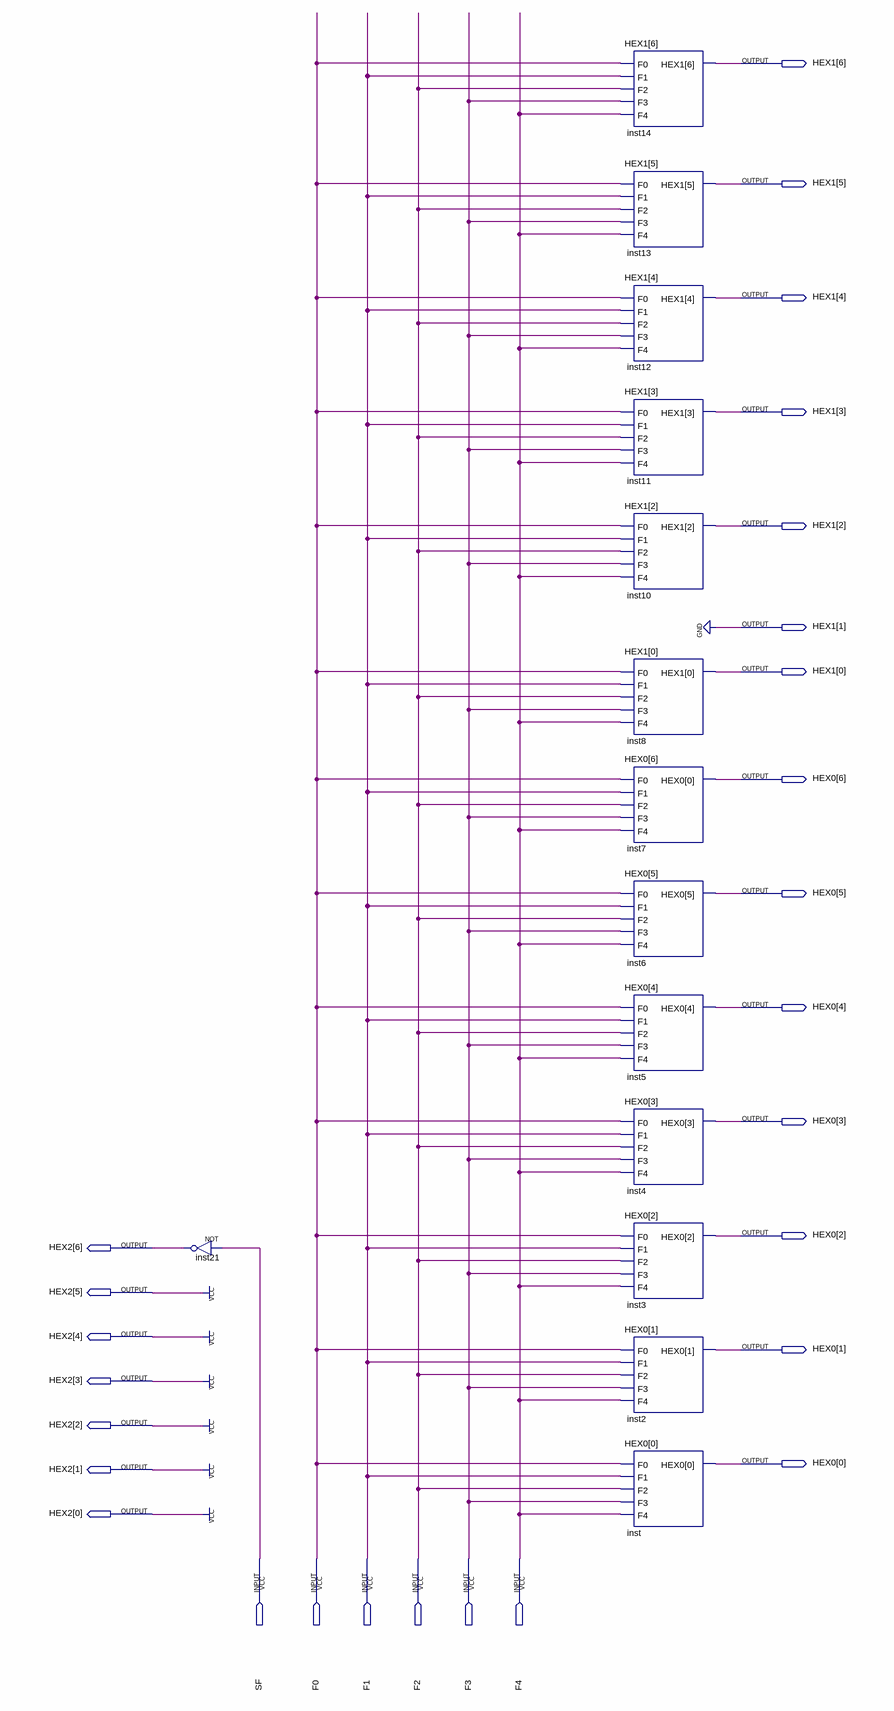
[diagram p0: schematic sheet]
// Quartus schematic Decodificador 7 segmentos.bdf as structural Verilog: 14 symbols, 27 pins
module \Decodificador_7_segmentos  (
  input  SF,
  input  F0,
  input  F1,
  input  F2,
  input  F3,
  input  F4,
  output [6:0] HEX1,
  output [6:0] HEX0,
  output [6:0] HEX2
);

  not inst21 (HEX2[6], SF);
  \HEX1[6]  inst14 (.F0(F0), .F1(F1), .F2(F2), .F3(F3), .F4(F4), .HEX1(HEX1[6]));
  \HEX1[5]  inst13 (.F0(F0), .F1(F1), .F2(F2), .F3(F3), .F4(F4), .HEX1(HEX1[5]));
  \HEX1[4]  inst12 (.F0(F0), .F1(F1), .F2(F2), .F3(F3), .F4(F4), .HEX1(HEX1[4]));
  \HEX1[3]  inst11 (.F0(F0), .F1(F1), .F2(F2), .F3(F3), .F4(F4), .HEX1(HEX1[3]));
  \HEX1[2]  inst10 (.F0(F0), .F1(F1), .F2(F2), .F3(F3), .F4(F4), .HEX1(HEX1[2]));
  \HEX1[0]  inst8 (.F0(F0), .F1(F1), .F2(F2), .F3(F3), .F4(F4), .HEX1(HEX1[0]));
  \HEX0[6]  inst7 (.F0(F0), .F1(F1), .F2(F2), .F3(F3), .F4(F4), .HEX0(HEX0[6]));
  \HEX0[5]  inst6 (.F0(F0), .F1(F1), .F2(F2), .F3(F3), .F4(F4), .HEX0(HEX0[5]));
  \HEX0[4]  inst5 (.F0(F0), .F1(F1), .F2(F2), .F3(F3), .F4(F4), .HEX0(HEX0[4]));
  \HEX0[3]  inst4 (.F0(F0), .F1(F1), .F2(F2), .F3(F3), .F4(F4), .HEX0(HEX0[3]));
  \HEX0[2]  inst3 (.F0(F0), .F1(F1), .F2(F2), .F3(F3), .F4(F4), .HEX0(HEX0[2]));
  \HEX0[1]  inst2 (.F0(F0), .F1(F1), .F2(F2), .F3(F3), .F4(F4), .HEX0(HEX0[1]));
  \HEX0[0]  inst (.F0(F0), .F1(F1), .F2(F2), .F3(F3), .F4(F4), .HEX0(HEX0[0]));

  assign HEX1[1] = 1'b0;
  assign HEX2[5:0] = {6{1'b1}};
endmodule
